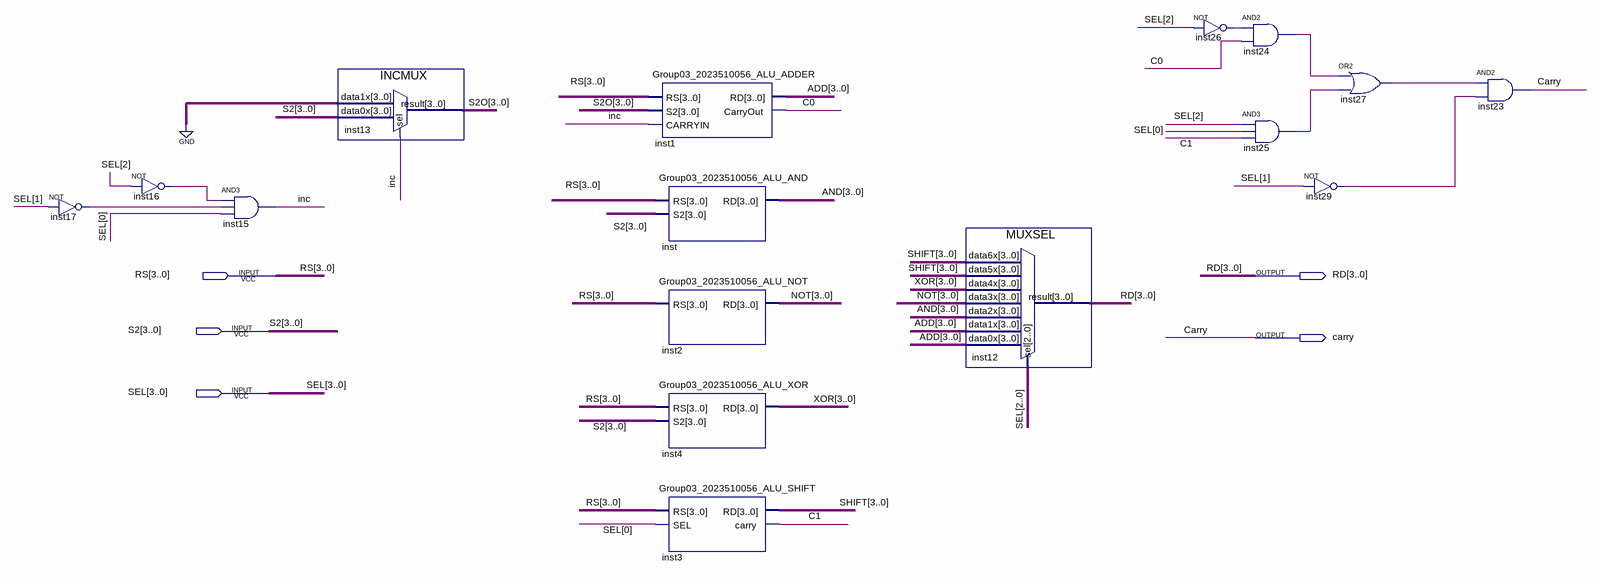
[diagram p0: schematic sheet]
// Quartus schematic Group03_2023510056_ALU.bdf as structural Verilog: 16 symbols, 5 pins
module Group03_2023510056_ALU (
  input  [3:0] RS,
  input  [3:0] S2,
  input  [3:0] SEL,
  output [3:0] RD,
  output carry
);

  wire C0, C1, inc, inst16_out, inst17_out, inst24_out, inst25_out, inst26_out, inst27_out, inst29_out;
  wire [3:0] ADD, AND, NOT, S2O, SHIFT, XOR;

  not inst17 (inst17_out, SEL[1]);
  not inst16 (inst16_out, SEL[2]);
  and inst15 (inc, inst16_out, inst17_out, SEL[0]);
  INCMUX inst13 (.data1x(4'b0000), .data0x(S2), .sel(inc), .result(S2O));
  Group03_2023510056_ALU_ADDER inst1 (.RS(RS), .S2(S2O), .CARRYIN(inc), .RD(ADD), .CarryOut(C0));
  Group03_2023510056_ALU_AND inst (.RS(RS), .S2(S2), .RD(AND));
  Group03_2023510056_ALU_NOT inst2 (.RS(RS), .RD(NOT));
  Group03_2023510056_ALU_XOR inst4 (.RS(RS), .S2(S2), .RD(XOR));
  Group03_2023510056_ALU_SHIFT inst3 (.RS(RS), .SEL(SEL[0]), .RD(SHIFT), .carry(C1));
  MUXSEL inst12 (
    .data6x(SHIFT), .data5x(SHIFT), .data4x(XOR), .data3x(NOT), .data2x(AND), .data1x(ADD), .data0x(ADD),
    .sel(SEL[2:0]), .result(RD));
  not inst26 (inst26_out, SEL[2]);
  and inst24 (inst24_out, inst26_out, C0);
  and inst25 (inst25_out, SEL[2], SEL[0], C1);
  or inst27 (inst27_out, inst24_out, inst25_out);
  not inst29 (inst29_out, SEL[1]);
  and inst23 (carry, inst27_out, inst29_out);
endmodule
